# EAGLE design 5Wled-mosfet (EAGLE 6.2)
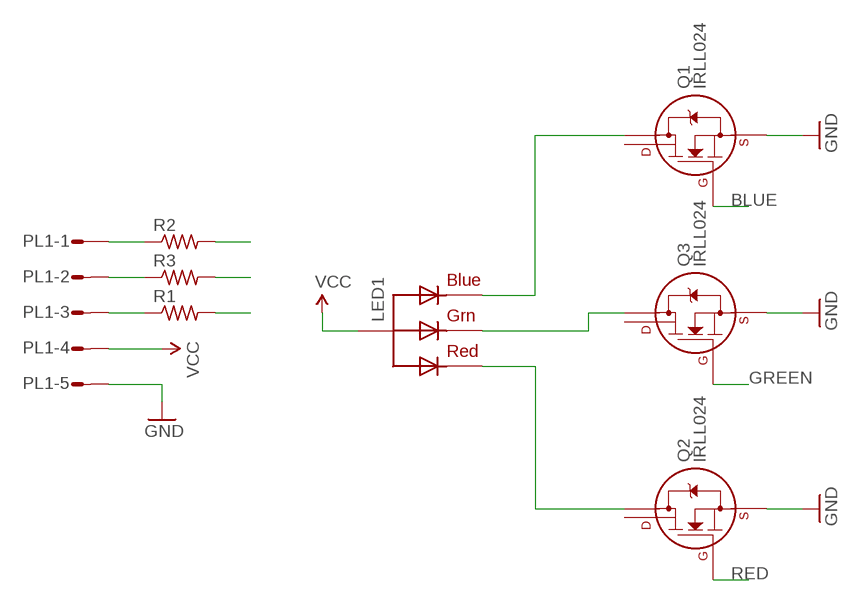
[diagram p0: schematic, sheet 1]

## Parts
LED1  RGBLED_CA4.5MM  [5WRGBLED]
PL1  DF3-05R  [DF3R-05]
Q1  IRLL024  [SOT-223]
Q2  IRLL024  [SOT-223]
Q3  IRLL024  [SOT-223]
R1  R-US_0204/5  [0204/5]
R2  R-US_0204/5  [0204/5]
R3  R-US_0204/5  [0204/5]

## Nets
BLUE: Q1.1(G) R1.2
GND: PL1.5 Q1.3(S) Q2.3(S) Q3.3(S)
GREEN: Q3.1(G) R3.2
N$1: LED1.1(BLUE) Q1.2(D1)
N$2: LED1.3(GREEN) Q3.2(D1)
N$3: LED1.2(RED) Q2.2(D1)
N$4: PL1.1 R2.1
N$5: PL1.2 R3.1
N$6: PL1.3 R1.1
RED: Q2.1(G) R2.2
VCC: LED1.4(VCC) PL1.4
Unconnected: Q1.4(D2) Q2.4(D2) Q3.4(D2)

## Library data of the parts
LED1 = adafruit:RGBLED_CA: RGB LED, common-anode 5MM Staggered pins 5mm Piranha package http://www.ladyada.net/library/pcb/eaglelibrary.html
PL1 = con-hirose-df3:DF3-05: Single row connector 2mm 5 way
Q1-Q3 = transistors:IRLL*: International Rectifier IRLL series N-channel enhancement mode MOSFET HEXFET Power MOSFET SOT-223 Includes body diode
R1-R3 = adafruit:R-US_: RESISTOR, American symbol

## Board
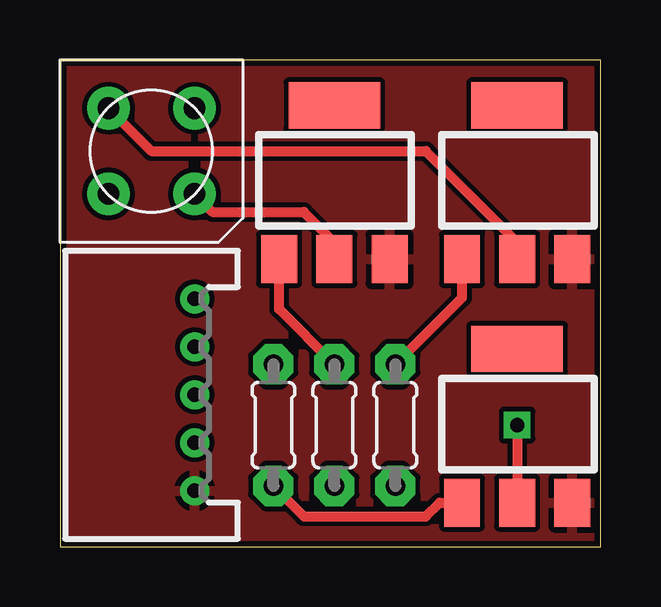
[diagram p1: board, top side]
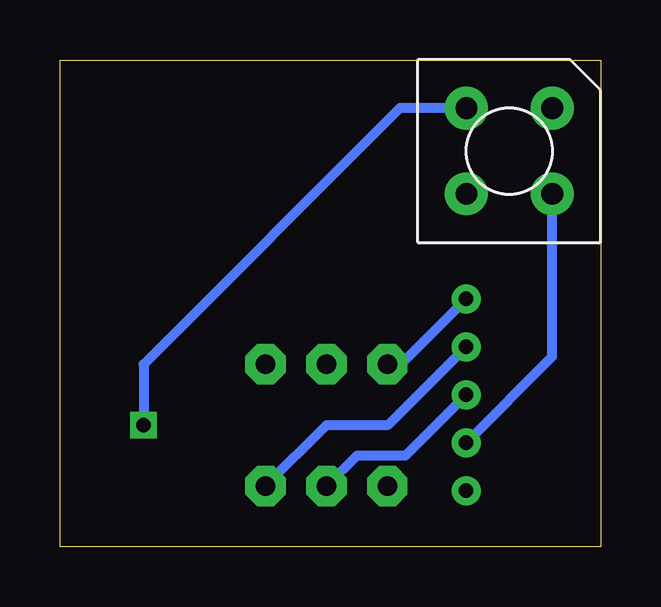
[diagram p2: board, bottom side, seen from below]

Size 22.53 x 20.31 mm. Coordinates in mm from the lower left corner, seen from the top.
Outline: 0,0 22.53,0 22.53,20.31 0,20.31 0,0
Copper layers (1*16): Top 0.035mm / dielectric 1.5mm / Bottom 0.035mm
Design rules: minimum track width 8mil, minimum drill 20mil, track to track 8mil, track to pad 8mil, pad to pad 8mil, via to via 8mil, smd to smd 8mil, copper to edge 10mil, drill to drill 8mil, minimum pad ring 12mil, minimum via ring 10mil, stop-mask expansion 4mil, vias tented up to drill 25mil, thermal gap 10mil

### Footprints (pad centres in the part's own frame; a part is rotated, then mirrored left to right if it is on the bottom)
5WRGBLED = drill 0.9 pad 1.778: 1 -1.79,1.79; 2 -1.79,-1.79; 3 1.79,-1.79; 4 1.79,1.79
DF3R-05 = drill 0.6: 1 -4,1.8; 2 -2,1.8; 3 0,1.8; 4 2,1.8; 5 4,1.8
SOT-223 = smd 1.499 x 2.007: 1 -2.3,-3.235; 2 0,-3.235; 3 2.3,-3.235 | smd 3.81 x 1.93: 4 0,3.175
0204/5 = drill 0.813 pad 1.676 octagon: 1 -2.54,0; 2 2.54,0

### Placement (x,y rotation side)
LED1  3.81,16.51 180 top
PL1  3.81,6.35 270 top
Q1  11.43,15.24 0 top
Q2  19.05,5.08 0 top
Q3  19.05,15.24 0 top
R1  11.43,5.08 90 top
R2  8.89,5.08 270 top
R3  13.97,5.08 90 top

### Tracks (layer width: path | path; a pad name or v marks a point on that pad's centre or on a via)
BLUE
  Top 0.406: R1.2 9.13,9.92 Q1.1
GND
  pour Top: 0,20.32 22.86,20.32 22.86,0 0,0
GREEN
  Top 0.406: R3.2 16.75,10.4 Q3.1
N$1
  Top 0.406: LED1.1 6.35,13.97 10.16,13.97 11.43,12.7 Q1.2
N$2
  Top 0.406: LED1.3 3.81,16.51 15.24,16.51 19.05,12.7 Q3.2
N$3  (via drill 0.6)
  Top 0.406: v19.05,5.08 Q2.2
  Bottom 0.406: LED1.2 8.37,18.3 19.05,7.62 v19.05,5.08
N$4
  Bottom 0.406: PL1.1 8.34,7.62 R2.1
N$5
  Bottom 0.406: PL1.2 8.88,5.08 11.43,5.08 R3.1
N$6
  Bottom 0.406: PL1.3 8.15,3.81 10.16,3.81 R1.1
RED
  Top 0.406: R2.2 10.16,1.27 15.24,1.27 15.82,1.84 Q2.1
VCC
  Bottom 0.406: PL1.4 2.02,7.94 LED1.4